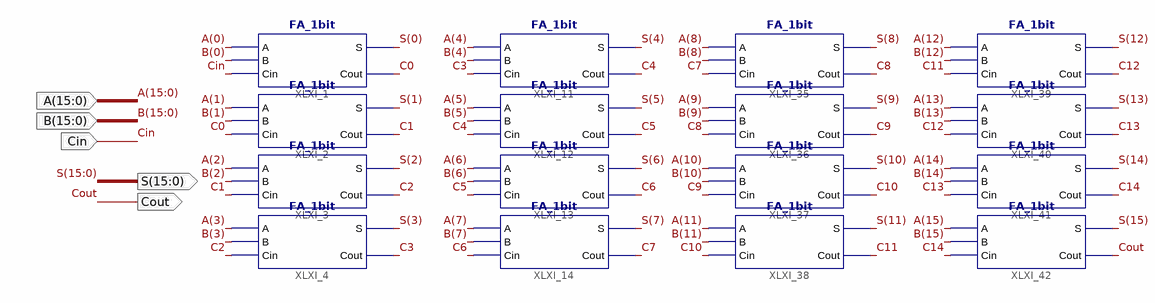
[diagram p0: schematic sheet 1]
// Xilinx ISE schematic FA_16bit.sch (virtex6) as structural Verilog: 16 symbols, 5 ports
module FA_16bit (
  input  [15:0] A,
  input  [15:0] B,
  input  Cin,
  output [15:0] S,
  output Cout
);

  wire C0, C1, C2, C3, C4, C5, C6, C7, C8, C9, C10, C11, C12, C13, C14;

  FA_1bit XLXI_1 (.Cin(Cin), .B(B[0]), .A(A[0]), .S(S[0]), .Cout(C0));
  FA_1bit XLXI_2 (.Cin(C0), .B(B[1]), .A(A[1]), .S(S[1]), .Cout(C1));
  FA_1bit XLXI_3 (.Cin(C1), .B(B[2]), .A(A[2]), .S(S[2]), .Cout(C2));
  FA_1bit XLXI_4 (.Cin(C2), .B(B[3]), .A(A[3]), .S(S[3]), .Cout(C3));
  FA_1bit XLXI_11 (.Cin(C3), .B(B[4]), .A(A[4]), .S(S[4]), .Cout(C4));
  FA_1bit XLXI_12 (.Cin(C4), .B(B[5]), .A(A[5]), .S(S[5]), .Cout(C5));
  FA_1bit XLXI_13 (.Cin(C5), .B(B[6]), .A(A[6]), .S(S[6]), .Cout(C6));
  FA_1bit XLXI_14 (.Cin(C6), .B(B[7]), .A(A[7]), .S(S[7]), .Cout(C7));
  FA_1bit XLXI_35 (.Cin(C7), .B(B[8]), .A(A[8]), .S(S[8]), .Cout(C8));
  FA_1bit XLXI_36 (.Cin(C8), .B(B[9]), .A(A[9]), .S(S[9]), .Cout(C9));
  FA_1bit XLXI_37 (.Cin(C9), .B(B[10]), .A(A[10]), .S(S[10]), .Cout(C10));
  FA_1bit XLXI_38 (.Cin(C10), .B(B[11]), .A(A[11]), .S(S[11]), .Cout(C11));
  FA_1bit XLXI_39 (.Cin(C11), .B(B[12]), .A(A[12]), .S(S[12]), .Cout(C12));
  FA_1bit XLXI_40 (.Cin(C12), .B(B[13]), .A(A[13]), .S(S[13]), .Cout(C13));
  FA_1bit XLXI_41 (.Cin(C13), .B(B[14]), .A(A[14]), .S(S[14]), .Cout(C14));
  FA_1bit XLXI_42 (.Cin(C14), .B(B[15]), .A(A[15]), .S(S[15]), .Cout(Cout));
endmodule
